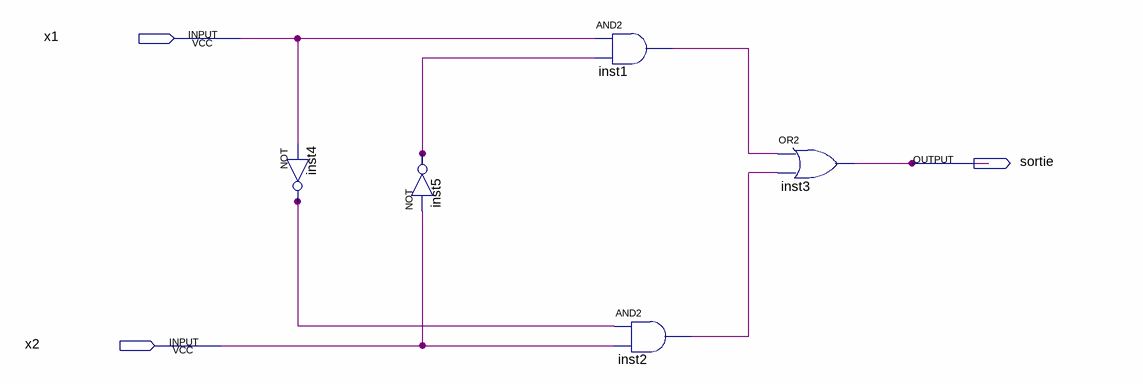
[diagram p0: schematic sheet]
// Quartus schematic TP1.bdf as structural Verilog: 5 symbols, 3 pins
module TP1 (
  input  x1,
  input  x2,
  output sortie
);

  wire inst1_out, inst2_out, inst4_out, inst5_out;

  not inst4 (inst4_out, x1);
  not inst5 (inst5_out, x2);
  and inst1 (inst1_out, x1, inst5_out);
  and inst2 (inst2_out, inst4_out, x2);
  or inst3 (sortie, inst1_out, inst2_out);
endmodule
